# EAGLE design paige (EAGLE 9.1.1)
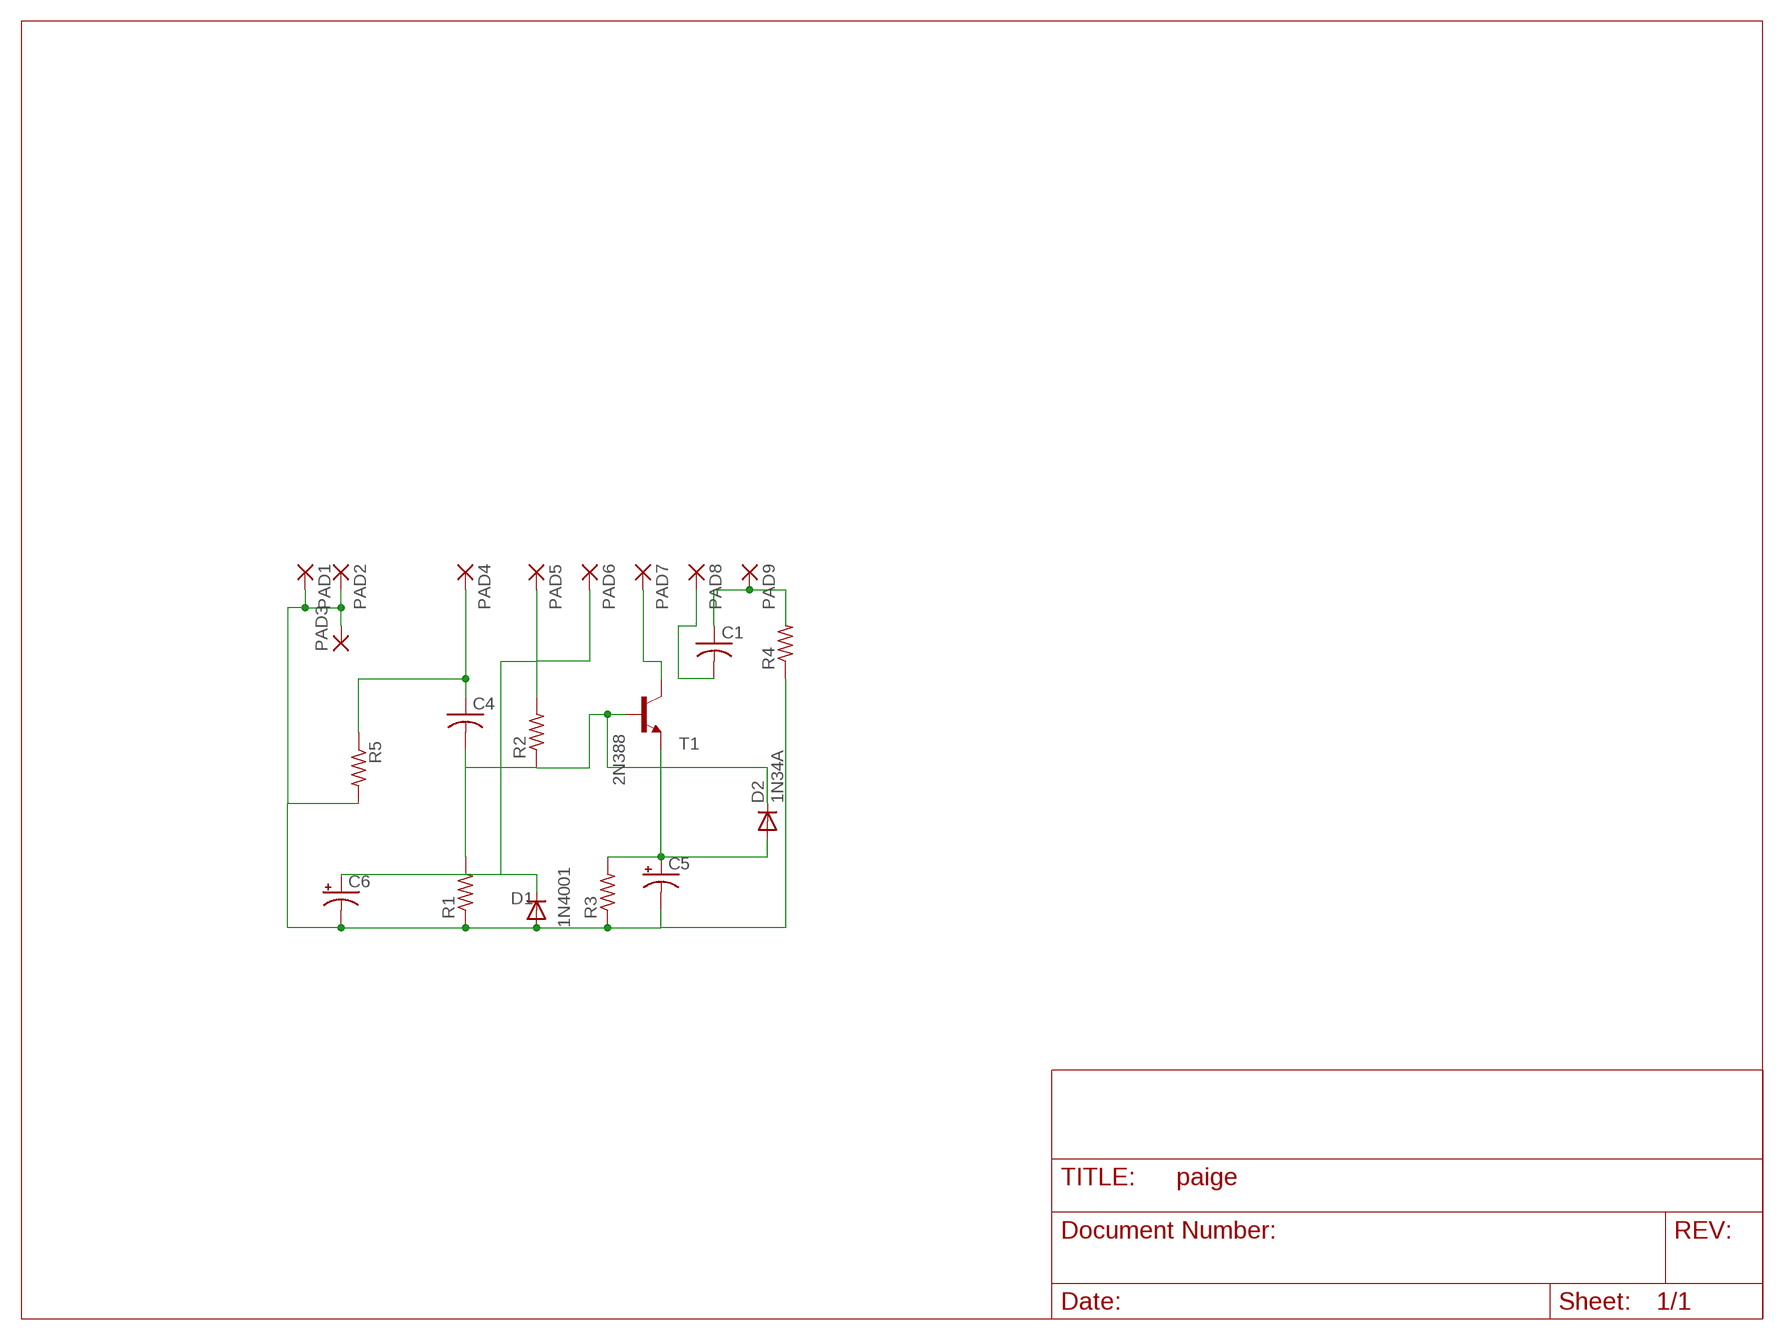
[diagram p0: schematic, sheet 1]

## Parts
C1  C-US025-050X050  [C025-050X050]
C4  C-US075-032X103  [C075-032X103]
C5  CPOL-USE2.5-7  [E2,5-7]
C6  CPOL-USE2.5-7  [E2,5-7]
D1  1N4001  1N4004  [DO41-10]
D2  1N34A  1N4004  [DO41-10]
PAD1  1,6/0,9  [1,6/0,9]
PAD2  1,6/0,9  [1,6/0,9]
PAD3  1,6/0,9  [1,6/0,9]
PAD4  1,6/0,9  [1,6/0,9]
PAD5  1,6/0,9  [1,6/0,9]
PAD6  1,6/0,9  [1,6/0,9]
PAD7  1,6/0,9  [1,6/0,9]
PAD8  1,6/0,9  [1,6/0,9]
PAD9  1,6/0,9  [1,6/0,9]
R1  R-US_0207/5V  [0207/5V]
R2  R-US_0207/5V  [0207/5V]
R3  R-US_0207/5V  [0207/5V]
R4  R-US_0207/5V  [0207/5V]
R5  R-US_0207/5V  [0207/5V]
T1  2N388  2N2222  [TO92-EBC-OVAL]

## Nets
N$4: C4.1 PAD4.1(P) R5.1
N$5: C4.2 D2.C R1.2 R2.1 T1.B
N$6: C6.+ D1.C PAD5.1(P) PAD6.1(P) R2.2
N$7: C5.+ D2.A R3.2 T1.E
N$14: C1.1 PAD9.1(P) R4.2
N$16: C5.- C6.- D1.A PAD1.1(P) PAD2.1(P) PAD3.1(P) R1.1 R3.1 R4.1 R5.2
N$20: PAD7.1(P) T1.C
N$21: C1.2 PAD8.1(P)

## Library data of the parts
C1 C4 = adafruit:C-US: CAPACITOR, American symbol
C5 C6 = adafruit:CPOL-US: POLARIZED CAPACITOR, American symbol
D1 D2 = adafruit:1N4004: DIODE General purpose 1N400x type rectifier (With bigger pads) http://www.ladyada.net/library/pcb/eaglelibrary.html
PAD1-PAD9 = wirepad:1,6/0,9: THROUGH-HOLE PAD
R1-R5 = adafruit:R-US_: RESISTOR, American symbol
T1 = adafruit:2N2222: NPN TRANSISTOR Big oval pads

## Board
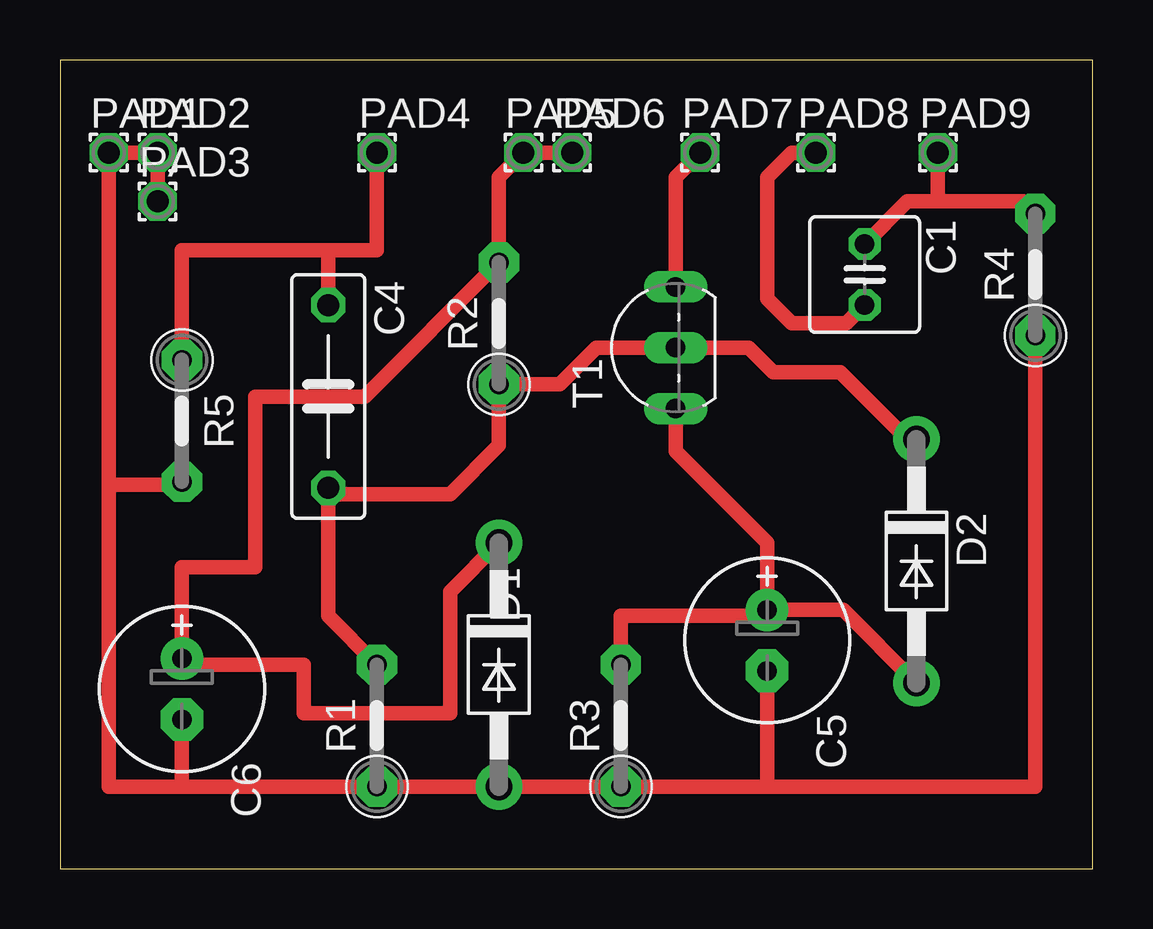
[diagram p1: board, top side]

Size 43.03 x 33.71 mm. Coordinates in mm from the lower left corner, seen from the top.
Outline: 0,0 43.03,0 43.03,33.71 0,33.71 0,0
Copper layers (1*16): Top 0.035mm / dielectric 1.5mm / Bottom 0.035mm
Design rules "default": minimum track width 6mil, minimum drill 0.35mm, track to track 6mil, track to pad 6mil, pad to pad 6mil, via to via 6mil, smd to smd 6mil, copper to edge 40mil, drill to drill 6mil, minimum pad ring 10mil, minimum via ring 8mil, stop-mask expansion 4mil, vias tented up to drill 0mil, thermal gap 10mil

### Footprints (pad centres in the part's own frame; a part is rotated, then mirrored left to right if it is on the bottom)
C025-050X050 = drill 0.813 octagon: 1 -1.27,0; 2 1.27,0
C075-032X103 = drill 0.914 octagon: 1 -3.81,0; 2 3.81,0
E2,5-7 = drill 0.813 pad 1.778: + -1.27,0 | drill 0.813 pad 1.778 octagon: - 1.27,0
DO41-10 = drill 1.118 pad 1.93: A 5.08,0; C -5.08,0
1,6/0,9 = drill 0.914 pad 1.6 octagon: 1 0,0
0207/5V = drill 0.813 pad 1.676 octagon: 1 -2.54,0; 2 2.54,0
TO92-EBC-OVAL = drill 0.813 long: B 0,-1.27; C 2.54,-1.27; E -2.54,-1.27

### Placement (x,y rotation side)
C1  33.53,24.77 270 top
C4  11.18,19.68 270 top
C5  29.46,9.53 270 top
C6  5.08,7.49 270 top
D1  18.29,8.51 270 top
D2  35.69,12.83 270 top
PAD1  2.03,29.84 0 top
PAD2  4.06,29.84 0 top
PAD3  4.06,27.81 0 top
PAD4  13.21,29.84 0 top
PAD5  19.3,29.84 0 top
PAD6  21.34,29.84 0 top
PAD7  26.67,29.84 0 top
PAD8  31.5,29.84 0 top
PAD9  36.58,29.84 0 top
R1  13.21,5.97 90 top
R2  18.29,22.73 90 top
R3  23.37,5.97 90 top
R4  40.64,24.77 90 top
R5  5.08,18.67 270 top
T1  24.38,21.72 90 top

### Tracks (layer width: path | path; a pad name or v marks a point on that pad's centre or on a via)
N$4
  Top 0.61: PAD4.1 13.21,25.78 11.18,25.78 | 11.18,25.78 5.08,25.78 R5.1 | 11.18,25.78 C4.1
N$5
  Top 0.61: D2.C 35.31,17.91 32.51,20.7 29.72,20.7 28.7,21.72 T1.B 22.35,21.72 20.83,20.19 R2.1 18.29,17.65 16.26,15.62 11.43,15.62 C4.2 11.18,10.54 R1.2
N$6
  Top 0.152: 5.33,8.51 5.21,8.64
  Top 0.61: PAD6.1 PAD5.1 18.29,28.83 R2.2 12.7,19.68 8.13,19.68 8.13,12.57 5.08,12.57 C6.+ | C6.+ 5.21,8.64 | C6.+ 5.33,8.51 10.16,8.51 10.16,6.48 16.26,6.48 16.26,11.56 D1.C
N$7
  Top 0.61: C5.+ 32.64,10.79 D2.A | R3.2 23.37,10.54 29.21,10.54 C5.+ | T1.E 25.65,17.4 29.46,13.59 C5.+
N$14
  Top 0.61: PAD9.1 36.58,27.81 | 36.58,27.81 35.31,27.81 C1.1 | 36.58,27.81 40.13,27.81 R4.2
N$16
  Top 0.61: PAD3.1 PAD2.1 PAD1.1 2.03,16 | 2.03,16 4.95,16 R5.2 | 2.03,16 2.03,3.43 5.08,3.43 | 5.08,3.43 R1.1 D1.A R3.1 29.46,3.43 | C6.- 5.08,3.43 | 29.46,3.43 C5.- | 29.46,3.43 40.64,3.43 R4.1
N$20
  Top 0.61: T1.C 25.65,28.83 PAD7.1
N$21
  Top 0.61: C1.2 32.77,22.73 30.48,22.73 29.46,23.75 29.46,28.83 30.48,29.84 PAD8.1